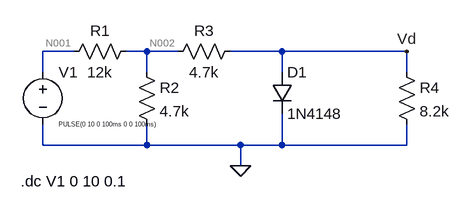
[diagram p0: schematic Draft2.asc]
Draft2.asc, the LTspice schematic file:
Version 4
SHEET 1 880 680
WIRE -48 96 -96 96
WIRE 64 96 32 96
WIRE 112 96 64 96
WIRE 272 96 192 96
WIRE 464 96 272 96
WIRE -96 128 -96 96
WIRE 64 128 64 96
WIRE 272 128 272 96
WIRE 464 128 464 96
WIRE -96 240 -96 208
WIRE 64 240 64 208
WIRE 64 240 -96 240
WIRE 208 240 64 240
WIRE 272 240 272 192
WIRE 272 240 208 240
WIRE 464 240 464 208
WIRE 464 240 272 240
WIRE 208 272 208 240
FLAG 208 272 0
FLAG 464 96 Vd
SYMBOL voltage -96 112 R0
WINDOW 3 24 96 Left 0
WINDOW 123 0 0 Left 0
WINDOW 39 0 0 Left 0
SYMATTR InstName V1
SYMATTR Value PULSE(0 10 0 100ms 0 0 100ms)
SYMBOL res 48 112 R0
SYMATTR InstName R2
SYMATTR Value 4.7k
SYMBOL res 48 80 R90
WINDOW 0 0 56 VBottom 2
WINDOW 3 32 56 VTop 2
SYMATTR InstName R1
SYMATTR Value 12k
SYMBOL res 208 80 R90
WINDOW 0 0 56 VBottom 2
WINDOW 3 32 56 VTop 2
SYMATTR InstName R3
SYMATTR Value 4.7k
SYMBOL diode 256 128 R0
SYMATTR InstName D1
SYMATTR Value 1N4148
SYMBOL res 448 112 R0
SYMATTR InstName R4
SYMATTR Value 8.2k
TEXT -130 296 Left 2 !.dc V1 0 10 0.1

The netlist it stands for:
* Draft2.asc
V1 N001 0 PULSE(0 10 0 100ms 0 0 100ms)
R2 N002 0 4.7k
R1 N002 N001 12k
R3 Vd N002 4.7k
D1 Vd 0 1N4148
R4 Vd 0 8.2k
.model D D
.lib standard.dio
.dc V1 0 10 0.1
.backanno
.end

* Results of the author's LTspice run, read from the files saved beside the schematic
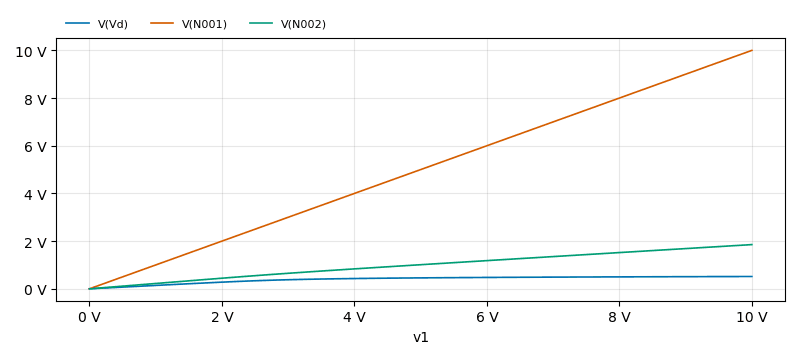
[diagram p1: DC transfer characteristic of Draft2.asc, plotted from the saved traces]
* DC transfer characteristic, 1 run:
*   V(Vd): 0 V at v1=0 V, 516 mV at v1=10 V, min 0 V, max 516 mV
*   V(N001): 0 V at v1=0 V, 10 V at v1=10 V, min 0 V, max 10 V
*   V(N002): 0 V at v1=0 V, 1.853 V at v1=10 V, min 0 V, max 1.853 V